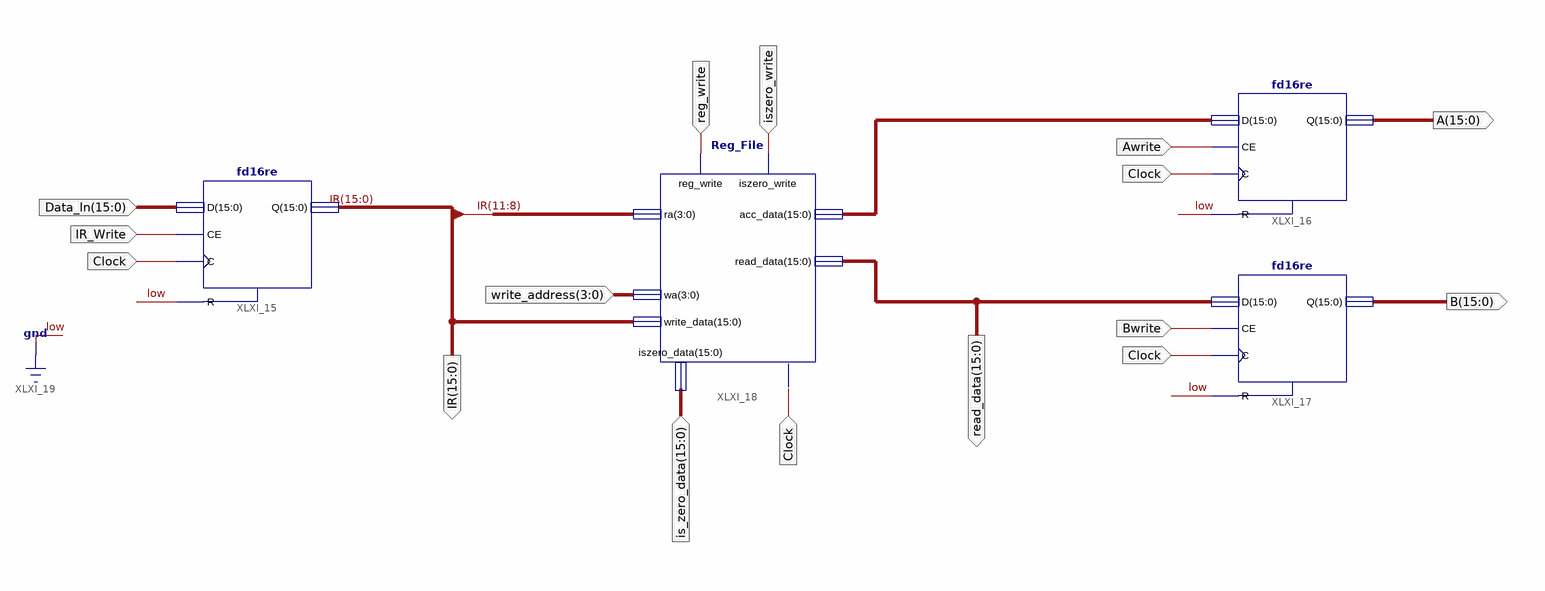
[diagram p0: schematic sheet 1]
// Xilinx ISE schematic Processor_Integration_1.sch (spartan3e) as structural Verilog: 4 symbols, 13 ports
module Processor_Integration_1 (
  input  reg_write,
  input  iszero_write,
  input  [3:0] write_address,
  input  [15:0] Data_In,
  input  Bwrite,
  input  Clock,
  input  IR_Write,
  input  [15:0] is_zero_data,
  input  Awrite,
  output [15:0] IR,
  output [15:0] read_data,
  output [15:0] A,
  output [15:0] B
);

  wire [15:0] XLXN_13;

  fd16re XLXI_15 (.C(Clock), .CE(IR_Write), .D(Data_In), .R(1'b0), .Q(IR));
  fd16re XLXI_16 (.C(Clock), .CE(Awrite), .D(XLXN_13), .R(1'b0), .Q(A));
  fd16re XLXI_17 (.C(Clock), .CE(Bwrite), .D(read_data), .R(1'b0), .Q(B));
  Reg_File XLXI_18 (
    .clock(Clock), .reg_write(reg_write), .iszero_write(iszero_write), .ra(IR[11:8]), .wa(write_address),
    .write_data(IR), .iszero_data(is_zero_data), .acc_data(XLXN_13), .read_data(read_data));
endmodule
